# Altium schematic sheet Connecors-Output.SchDoc: =ProjectDescription
size 420 x 297 mm; Address1: Address1; Address2: Address2; Address3: Address3; Address4: Address4; SheetNumber: 2; SheetTotal: 4; Scale: 1:1; DocumentType: Схема электрическая принципиальная
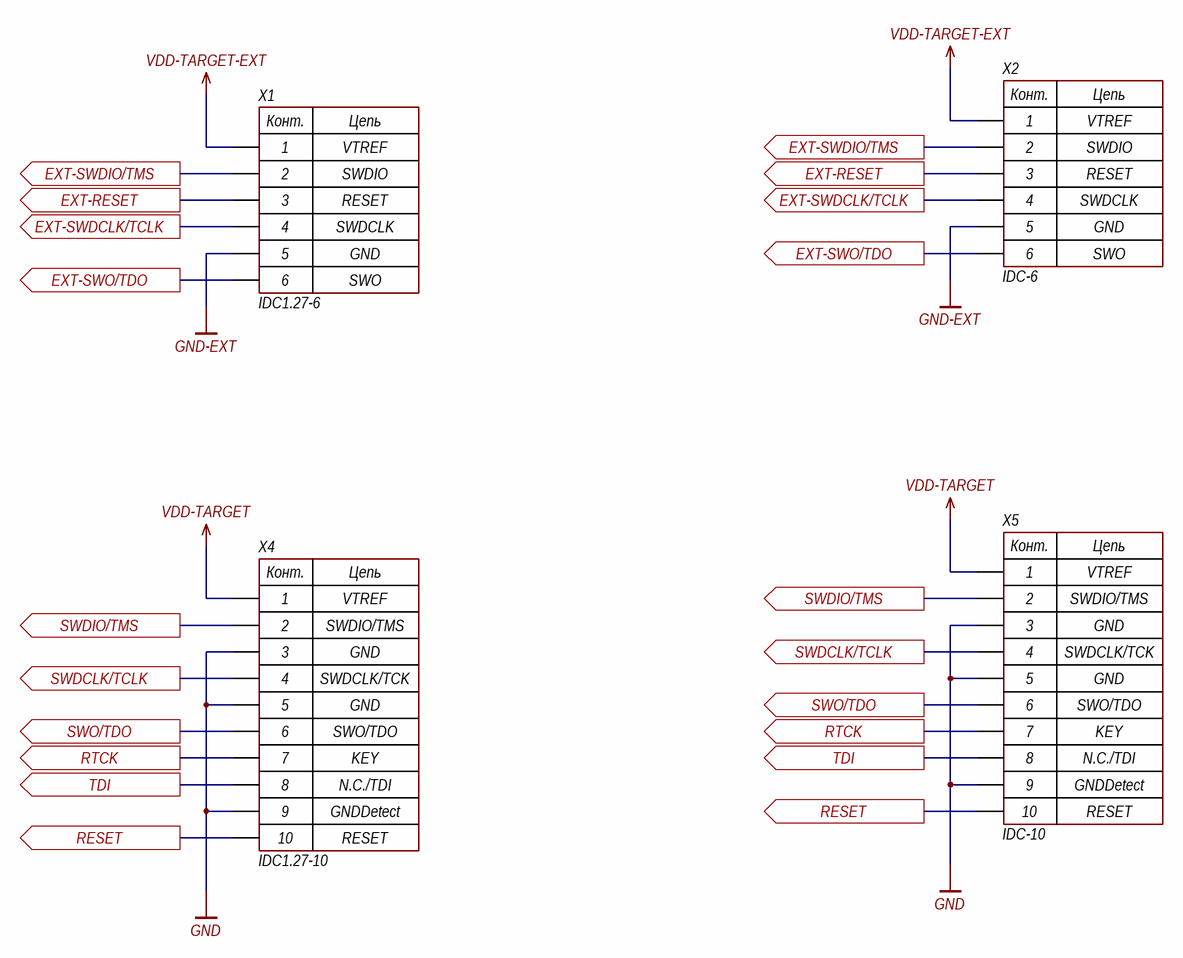
[diagram p0: Connecors-Output.SchDoc]

## Parts
X1  IDC1.27-6  [CON: IDC1.27-6]
X2  IDC-6  [CON: IDC-6MS]
X4  IDC1.27-10  [CON: IDC1.27-10]
X5  IDC-10  [CON: IDC-10MS]

## Ports
EXT-RESET (out), EXT-SWDCLK/TCLK (out), EXT-SWDIO/TMS (out), EXT-SWO/TDO (out), RESET (out), RTCK (out), SWDCLK/TCLK (out), SWDIO/TMS (out), SWO/TDO (out), TDI (out)

## Nets
GND: X4.3 X4.5 X4.9 X5.3 X5.5 X5.9
GND-EXT: X1.5 X2.5
VDD-TARGET: X4.1 X5.1
VDD-TARGET-EXT: X1.1 X2.1
EXT-RESET: X1.3 X2.3 ; port EXT-RESET
EXT-SWDCLK/TCLK: X1.4 X2.4 ; port EXT-SWDCLK/TCLK
EXT-SWDIO/TMS: X1.2 X2.2 ; port EXT-SWDIO/TMS
EXT-SWO/TDO: X1.6 X2.6 ; port EXT-SWO/TDO
RESET: X4.10 X5.10 ; port RESET
RTCK: X4.7 X5.7 ; port RTCK
SWDCLK/TCLK: X4.4 X5.4 ; port SWDCLK/TCLK
SWDIO/TMS: X4.2 X5.2 ; port SWDIO/TMS
SWO/TDO: X4.6 X5.6 ; port SWO/TDO
TDI: X4.8 X5.8 ; port TDI

## Notes on the sheet
- VTREF
- SWDIO
- SWDCLK
- RESET
- GND
- SWO
- SWDIO/TMS
- SWDCLK/TCK
- KEY
- SWO/TDO
- N.C./TDI
- GNDDetect
- Изм.
- Лист
- № докум.
- Подп.
- Дата
- 2.106-A3
- Копировал
- Формат А3
- (in symbol 6-Connector) Конт.; Цепь
- (in symbol 10-Connector) Конт.; Цепь

## Library data of the parts
X1 X2 = 6-Connector: Manufacturer: *; HelpURL: *; ComponentKind: *; ClassName: *
  X1: Model: IDC1.27-6
  X2: Model: IDC-6
X4 X5 = 10-Connector: Manufacturer: *; HelpURL: *; ComponentKind: *; ClassName: *
  X4: Model: IDC1.27-10
  X5: Model: IDC-10